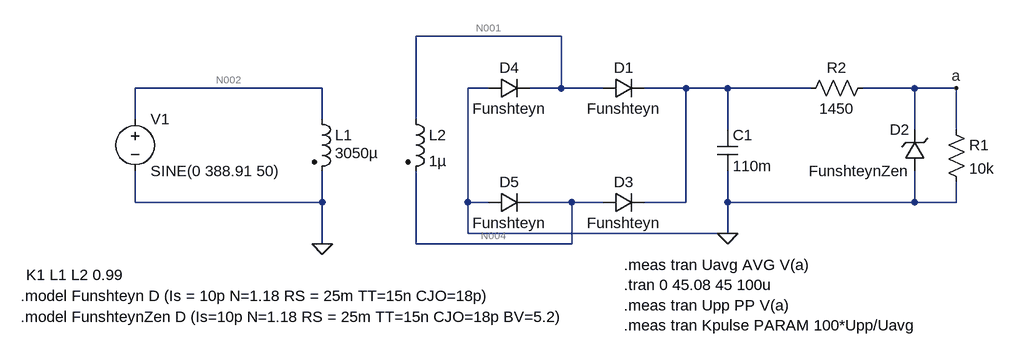
[diagram p0: schematic Draft4.asc]
Draft4.asc, the LTspice schematic file:
Version 4
SHEET 1 1172 680
WIRE 496 -64 272 -64
WIRE 128 16 -160 16
WIRE 384 16 352 16
WIRE 496 16 496 -64
WIRE 496 16 448 16
WIRE 560 16 496 16
WIRE 688 16 624 16
WIRE 752 16 688 16
WIRE 880 16 752 16
WIRE 1040 16 960 16
WIRE 1104 16 1040 16
WIRE -160 64 -160 16
WIRE 128 64 128 16
WIRE 272 64 272 -64
WIRE 752 80 752 16
WIRE 1040 80 1040 16
WIRE 1104 80 1104 16
WIRE -160 192 -160 144
WIRE 128 192 128 144
WIRE 128 192 -160 192
WIRE 352 192 352 16
WIRE 384 192 352 192
WIRE 512 192 448 192
WIRE 560 192 512 192
WIRE 688 192 688 16
WIRE 688 192 624 192
WIRE 752 192 752 144
WIRE 1040 192 1040 144
WIRE 1040 192 752 192
WIRE 1104 192 1104 160
WIRE 1104 192 1040 192
WIRE 352 240 352 192
WIRE 752 240 752 192
WIRE 752 240 352 240
WIRE 128 256 128 192
WIRE 272 256 272 144
WIRE 512 256 512 192
WIRE 512 256 272 256
FLAG 128 256 0
FLAG 1104 16 a
FLAG 752 240 0
SYMBOL voltage -160 48 R0
WINDOW 123 0 0 Left 0
WINDOW 39 0 0 Left 0
SYMATTR InstName V1
SYMATTR Value SINE(0 388.91 50)
SYMBOL ind2 112 48 R0
WINDOW 3 36 68 Left 2
SYMATTR InstName L1
SYMATTR Value 3050µ
SYMATTR SpiceLine Rser=1n
SYMBOL ind2 256 48 R0
SYMATTR InstName L2
SYMATTR Value 1µ
SYMATTR SpiceLine Rser=1n
SYMBOL diode 560 32 R270
WINDOW 0 32 32 VTop 2
WINDOW 3 0 32 VBottom 2
SYMATTR InstName D1
SYMATTR Value Funshteyn
SYMBOL cap 736 80 R0
SYMATTR InstName C1
SYMATTR Value 110m
SYMBOL res 1088 64 R0
SYMATTR InstName R1
SYMATTR Value 10k
SYMBOL zener 1056 144 R180
WINDOW 0 24 64 Left 2
WINDOW 3 24 0 Left 2
SYMATTR InstName D2
SYMATTR Value FunshteynZen
SYMBOL res 976 0 R90
WINDOW 0 0 56 VBottom 2
WINDOW 3 32 56 VTop 2
SYMATTR InstName R2
SYMATTR Value 1450
SYMBOL diode 560 208 R270
WINDOW 0 32 32 VTop 2
WINDOW 3 0 32 VBottom 2
SYMATTR InstName D3
SYMATTR Value Funshteyn
SYMBOL diode 384 32 R270
WINDOW 0 32 32 VTop 2
WINDOW 3 0 32 VBottom 2
SYMATTR InstName D4
SYMATTR Value Funshteyn
SYMBOL diode 384 208 R270
WINDOW 0 32 32 VTop 2
WINDOW 3 0 32 VBottom 2
SYMATTR InstName D5
SYMATTR Value Funshteyn
TEXT -328 304 Left 2 !K1 L1 L2 0.99
TEXT -336 336 Left 2 !.model Funshteyn D (Is = 10p N=1.18 RS = 25m TT=15n CJO=18p)
TEXT 592 288 Left 2 !.meas tran Uavg AVG V(a)\n.tran 0 45.08 45 100u\n.meas tran Upp PP V(a)\n.meas tran Kpulse PARAM 100*Upp/Uavg
TEXT -336 368 Left 2 !.model FunshteynZen D (Is=10p N=1.18 RS = 25m TT=15n CJO=18p BV=5.2)

The netlist it stands for:
* Draft4.asc
V1 N002 0 SINE(0 388.91 50)
L1 N002 0 3050µ Rser=1n
L2 N001 N004 1µ Rser=1n
D1 N001 N003 Funshteyn
C1 N003 0 110m
R1 a 0 10k
D2 0 a FunshteynZen
R2 a N003 1450
D3 N004 N003 Funshteyn
D4 0 N001 Funshteyn
D5 0 N004 Funshteyn
.model D D
.lib standard.dio
K1 L1 L2 0.99
.model Funshteyn D (Is = 10p N=1.18 RS = 25m TT=15n CJO=18p)
.meas tran Uavg AVG V(a)
.tran 0 45.08 45 100u
.meas tran Upp PP V(a)
.meas tran Kpulse PARAM 100*Upp/Uavg
.model FunshteynZen D (Is=10p N=1.18 RS = 25m TT=15n CJO=18p BV=5.2)
.backanno
.end

* Results of the author's LTspice run, read from the files saved beside the schematic
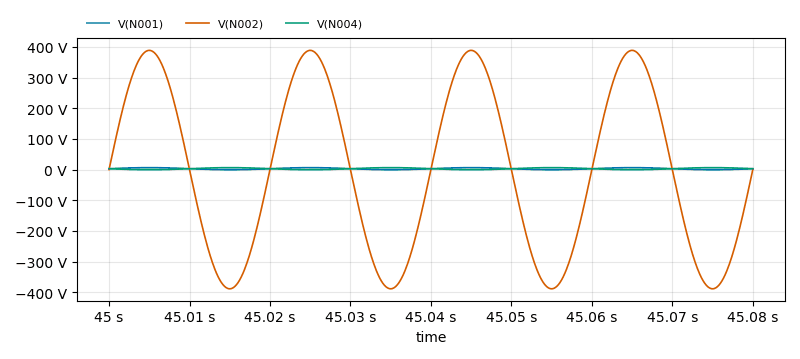
[diagram p1: Transient Analysis of Draft4.asc, plotted from the saved traces]
* Transient Analysis, 1 run:
*   V(N001): min -620.6 mV, max 6.349 V, average 2.864 V, rms 3.778 V, last 2.864 V
*   V(N002): min -388.9 V, max 388.9 V, average 0 V, rms 275 V, last 0 V
*   V(N004): min -620.6 mV, max 6.349 V, average 2.864 V, rms 3.778 V, last 2.864 V